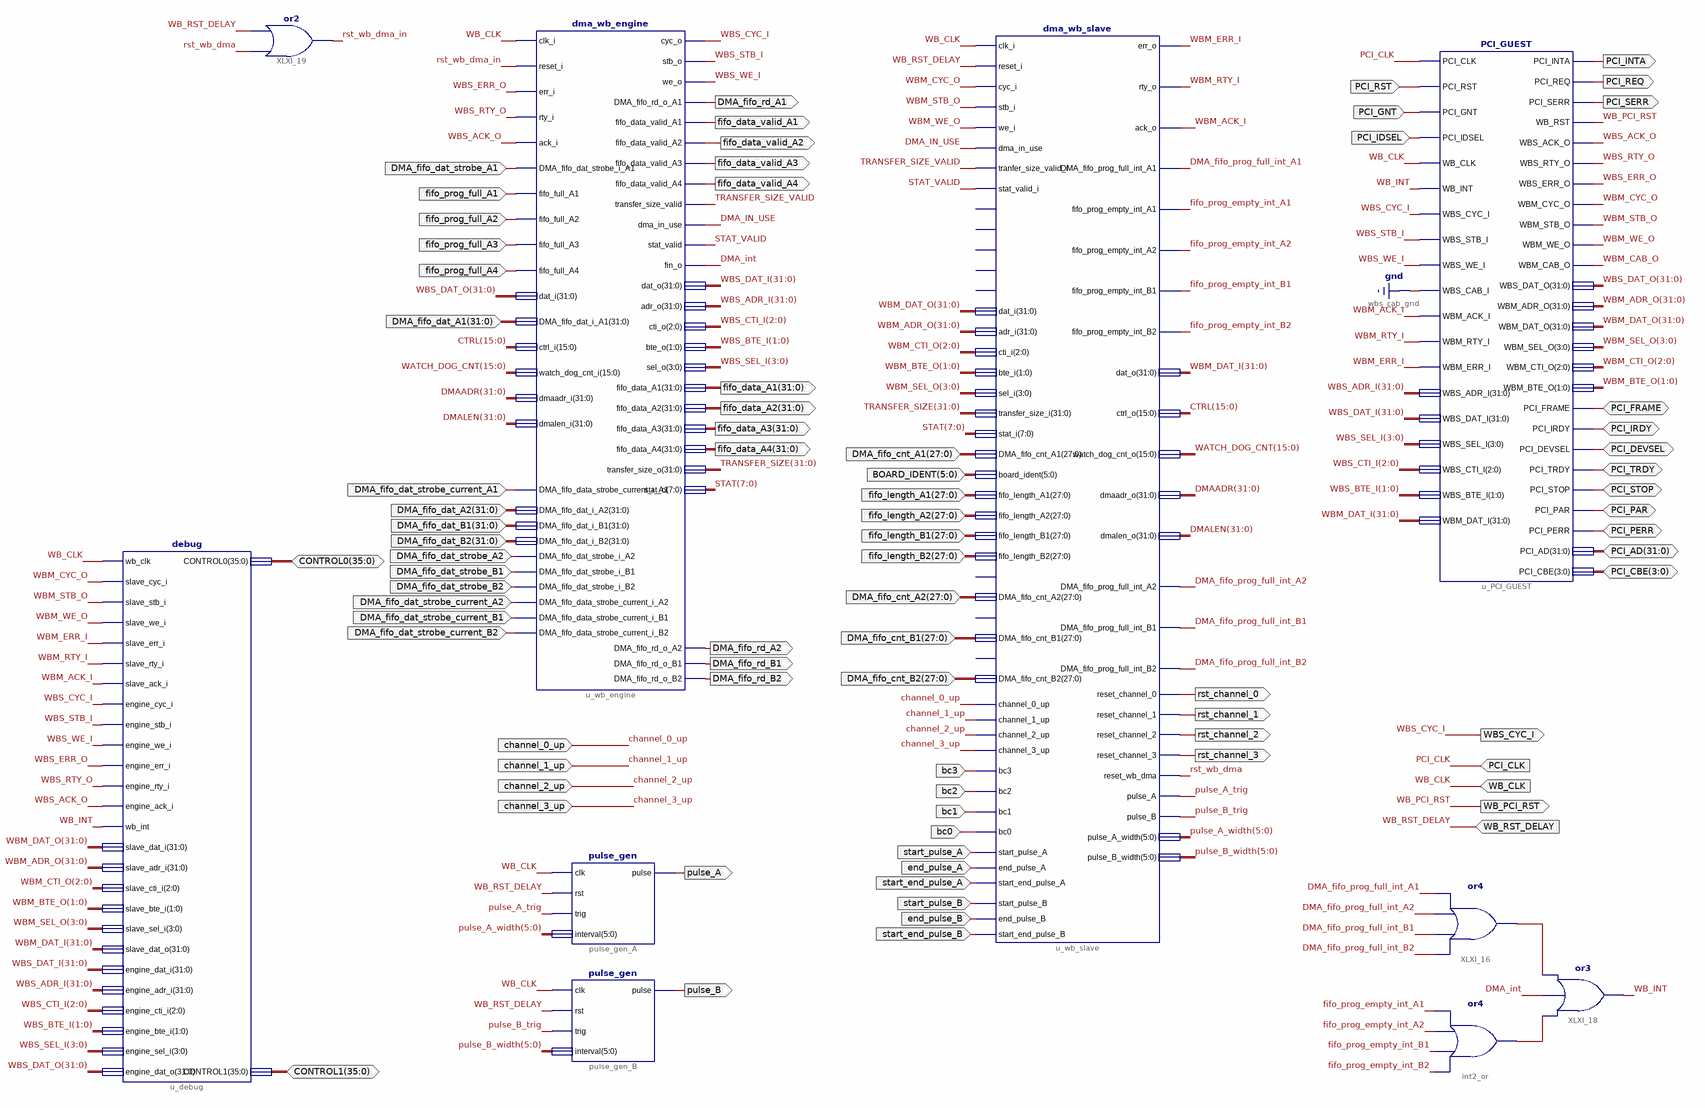
[diagram p0: schematic sheet 1]
// Xilinx ISE schematic DMA_INTERFACE.sch (spartan6) as structural Verilog: 10 symbols, 79 ports
module DMA_INTERFACE (
  input  PCI_CLK,
  input  WB_CLK,
  input  WB_RST_DELAY,
  input  PCI_RST,
  input  PCI_GNT,
  input  PCI_IDSEL,
  input  [27:0] DMA_fifo_cnt_A1,
  input  [5:0] BOARD_IDENT,
  input  [27:0] fifo_length_A1,
  input  [27:0] fifo_length_A2,
  input  [27:0] fifo_length_B1,
  input  [27:0] fifo_length_B2,
  input  [27:0] DMA_fifo_cnt_A2,
  input  [27:0] DMA_fifo_cnt_B1,
  input  [27:0] DMA_fifo_cnt_B2,
  input  DMA_fifo_dat_strobe_A1,
  input  fifo_prog_full_A1,
  input  fifo_prog_full_A2,
  input  fifo_prog_full_A3,
  input  fifo_prog_full_A4,
  input  [31:0] DMA_fifo_dat_A1,
  input  DMA_fifo_dat_strobe_current_A1,
  input  DMA_fifo_dat_strobe_A2,
  input  DMA_fifo_dat_strobe_B1,
  input  DMA_fifo_dat_strobe_B2,
  input  DMA_fifo_dat_strobe_current_A2,
  input  DMA_fifo_dat_strobe_current_B1,
  input  DMA_fifo_dat_strobe_current_B2,
  input  [31:0] DMA_fifo_dat_A2,
  input  [31:0] DMA_fifo_dat_B1,
  input  [31:0] DMA_fifo_dat_B2,
  input  channel_0_up,
  input  channel_1_up,
  input  channel_2_up,
  input  channel_3_up,
  input  bc3,
  input  bc2,
  input  bc1,
  input  bc0,
  input  start_pulse_A,
  input  end_pulse_A,
  input  start_end_pulse_A,
  input  start_pulse_B,
  input  end_pulse_B,
  input  start_end_pulse_B,
  inout  PCI_FRAME,
  inout  PCI_IRDY,
  inout  PCI_DEVSEL,
  inout  PCI_TRDY,
  inout  PCI_STOP,
  inout  PCI_PAR,
  inout  PCI_PERR,
  inout  [31:0] PCI_AD,
  inout  [3:0] PCI_CBE,
  inout  [35:0] CONTROL0,
  inout  [35:0] CONTROL1,
  output WB_PCI_RST,
  output WBS_CYC_I,
  output PCI_INTA,
  output PCI_REQ,
  output PCI_SERR,
  output DMA_fifo_rd_A1,
  output fifo_data_valid_A1,
  output fifo_data_valid_A2,
  output fifo_data_valid_A3,
  output fifo_data_valid_A4,
  output [31:0] fifo_data_A1,
  output [31:0] fifo_data_A2,
  output [31:0] fifo_data_A3,
  output [31:0] fifo_data_A4,
  output DMA_fifo_rd_A2,
  output DMA_fifo_rd_B1,
  output DMA_fifo_rd_B2,
  output rst_channel_0,
  output rst_channel_1,
  output rst_channel_2,
  output rst_channel_3,
  output pulse_A,
  output pulse_B
);

  wire DMA_fifo_prog_full_int_A1, DMA_fifo_prog_full_int_A2, DMA_fifo_prog_full_int_B1,
       DMA_fifo_prog_full_int_B2, DMA_IN_USE, DMA_int, fifo_prog_empty_int_A1, fifo_prog_empty_int_A2,
       fifo_prog_empty_int_B1, fifo_prog_empty_int_B2, pulse_A_trig, pulse_B_trig, rst_wb_dma, rst_wb_dma_in,
       STAT_VALID, TRANSFER_SIZE_VALID, WB_INT, WBM_ACK_I, WBM_CAB_O, WBM_CYC_O, WBM_ERR_I, WBM_RTY_I,
       WBM_STB_O, WBM_WE_O, WBS_ACK_O, WBS_ERR_O, WBS_RTY_O, WBS_STB_I, WBS_WE_I, XLXN_106, XLXN_120;
  wire [1:0] WBM_BTE_O, WBS_BTE_I;
  wire [2:0] WBM_CTI_O, WBS_CTI_I;
  wire [3:0] WBM_SEL_O, WBS_SEL_I;
  wire [5:0] pulse_A_width, pulse_B_width;
  wire [7:0] STAT;
  wire [15:0] CTRL, WATCH_DOG_CNT;
  wire [31:0] DMAADR, DMALEN, TRANSFER_SIZE, WBM_ADR_O, WBM_DAT_I, WBM_DAT_O, WBS_ADR_I, WBS_DAT_I, WBS_DAT_O;

  or int2_or (XLXN_106, fifo_prog_empty_int_B2, fifo_prog_empty_int_B1, fifo_prog_empty_int_A2, fifo_prog_empty_int_A1);
  or XLXI_18 (WB_INT, XLXN_106, DMA_int, XLXN_120);
  or XLXI_16 (XLXN_120, DMA_fifo_prog_full_int_B2, DMA_fifo_prog_full_int_B1, DMA_fifo_prog_full_int_A2, DMA_fifo_prog_full_int_A1);
  PCI_GUEST u_PCI_GUEST (
    .PCI_CLK(PCI_CLK), .PCI_RST(PCI_RST), .PCI_GNT(PCI_GNT), .PCI_IDSEL(PCI_IDSEL), .WB_CLK(WB_CLK),
    .WB_INT(WB_INT), .WBS_CYC_I(WBS_CYC_I), .WBS_STB_I(WBS_STB_I), .WBS_WE_I(WBS_WE_I), .WBS_CAB_I(1'b0),
    .WBM_ACK_I(WBM_ACK_I), .WBM_RTY_I(WBM_RTY_I), .WBM_ERR_I(WBM_ERR_I), .WBS_ADR_I(WBS_ADR_I),
    .WBS_DAT_I(WBS_DAT_I), .WBS_SEL_I(WBS_SEL_I), .WBS_CTI_I(WBS_CTI_I), .WBS_BTE_I(WBS_BTE_I),
    .WBM_DAT_I(WBM_DAT_I), .PCI_INTA(PCI_INTA), .PCI_REQ(PCI_REQ), .PCI_SERR(PCI_SERR), .WB_RST(WB_PCI_RST),
    .WBS_ACK_O(WBS_ACK_O), .WBS_RTY_O(WBS_RTY_O), .WBS_ERR_O(WBS_ERR_O), .WBM_CYC_O(WBM_CYC_O),
    .WBM_STB_O(WBM_STB_O), .WBM_WE_O(WBM_WE_O), .WBM_CAB_O(WBM_CAB_O), .WBS_DAT_O(WBS_DAT_O),
    .WBM_ADR_O(WBM_ADR_O), .WBM_DAT_O(WBM_DAT_O), .WBM_SEL_O(WBM_SEL_O), .WBM_CTI_O(WBM_CTI_O),
    .WBM_BTE_O(WBM_BTE_O), .PCI_FRAME(PCI_FRAME), .PCI_IRDY(PCI_IRDY), .PCI_DEVSEL(PCI_DEVSEL),
    .PCI_TRDY(PCI_TRDY), .PCI_STOP(PCI_STOP), .PCI_PAR(PCI_PAR), .PCI_PERR(PCI_PERR), .PCI_AD(PCI_AD),
    .PCI_CBE(PCI_CBE));
  dma_wb_slave u_wb_slave (
    .clk_i(WB_CLK), .reset_i(WB_RST_DELAY), .cyc_i(WBM_CYC_O), .stb_i(WBM_STB_O), .we_i(WBM_WE_O),
    .dma_in_use(DMA_IN_USE), .tranfer_size_valid_i(TRANSFER_SIZE_VALID), .stat_valid_i(STAT_VALID),
    .dat_i(WBM_DAT_O), .adr_i(WBM_ADR_O), .cti_i(WBM_CTI_O), .bte_i(WBM_BTE_O), .sel_i(WBM_SEL_O),
    .transfer_size_i(TRANSFER_SIZE), .stat_i(STAT), .DMA_fifo_cnt_A1(DMA_fifo_cnt_A1),
    .board_ident(BOARD_IDENT), .fifo_length_A1(fifo_length_A1), .fifo_length_A2(fifo_length_A2),
    .fifo_length_B1(fifo_length_B1), .fifo_length_B2(fifo_length_B2), .err_o(WBM_ERR_I), .rty_o(WBM_RTY_I),
    .ack_o(WBM_ACK_I), .DMA_fifo_prog_full_int_A1(DMA_fifo_prog_full_int_A1),
    .fifo_prog_empty_int_A1(fifo_prog_empty_int_A1), .fifo_prog_empty_int_A2(fifo_prog_empty_int_A2),
    .fifo_prog_empty_int_B1(fifo_prog_empty_int_B1), .fifo_prog_empty_int_B2(fifo_prog_empty_int_B2),
    .dat_o(WBM_DAT_I), .ctrl_o(CTRL), .watch_dog_cnt_o(WATCH_DOG_CNT), .dmaadr_o(DMAADR), .dmalen_o(DMALEN),
    .DMA_fifo_cnt_A2(DMA_fifo_cnt_A2), .DMA_fifo_cnt_B1(DMA_fifo_cnt_B1), .DMA_fifo_cnt_B2(DMA_fifo_cnt_B2),
    .DMA_fifo_prog_full_int_A2(DMA_fifo_prog_full_int_A2),
    .DMA_fifo_prog_full_int_B1(DMA_fifo_prog_full_int_B1),
    .DMA_fifo_prog_full_int_B2(DMA_fifo_prog_full_int_B2), .reset_channel_0(rst_channel_0),
    .reset_channel_1(rst_channel_1), .reset_channel_2(rst_channel_2), .reset_channel_3(rst_channel_3),
    .reset_wb_dma(rst_wb_dma), .channel_0_up(channel_0_up), .channel_1_up(channel_1_up),
    .channel_2_up(channel_2_up), .channel_3_up(channel_3_up), .pulse_A(pulse_A_trig), .pulse_B(pulse_B_trig),
    .pulse_A_width(pulse_A_width), .pulse_B_width(pulse_B_width), .bc3(bc3), .bc2(bc2), .bc1(bc1), .bc0(bc0),
    .start_pulse_A(start_pulse_A), .end_pulse_A(end_pulse_A), .start_end_pulse_A(start_end_pulse_A),
    .start_pulse_B(start_pulse_B), .end_pulse_B(end_pulse_B), .start_end_pulse_B(start_end_pulse_B));  // open: DMA_fifo_prog_full_A1, fifo_prog_empty_A1, fifo_prog_empty_A2, fifo_prog_empty_B1, fifo_prog_empty_B2, DMA_fifo_prog_full_A2, DMA_fifo_prog_full_B1, DMA_fifo_prog_full_B2
  dma_wb_engine u_wb_engine (
    .clk_i(WB_CLK), .reset_i(rst_wb_dma_in), .err_i(WBS_ERR_O), .rty_i(WBS_RTY_O), .ack_i(WBS_ACK_O),
    .DMA_fifo_dat_strobe_i_A1(DMA_fifo_dat_strobe_A1), .fifo_full_A1(fifo_prog_full_A1),
    .fifo_full_A2(fifo_prog_full_A2), .fifo_full_A3(fifo_prog_full_A3), .fifo_full_A4(fifo_prog_full_A4),
    .dat_i(WBS_DAT_O), .DMA_fifo_dat_i_A1(DMA_fifo_dat_A1), .ctrl_i(CTRL), .watch_dog_cnt_i(WATCH_DOG_CNT),
    .dmaadr_i(DMAADR), .dmalen_i(DMALEN), .cyc_o(WBS_CYC_I), .stb_o(WBS_STB_I), .we_o(WBS_WE_I),
    .DMA_fifo_rd_o_A1(DMA_fifo_rd_A1), .fifo_data_valid_A1(fifo_data_valid_A1),
    .fifo_data_valid_A2(fifo_data_valid_A2), .fifo_data_valid_A3(fifo_data_valid_A3),
    .fifo_data_valid_A4(fifo_data_valid_A4), .transfer_size_valid(TRANSFER_SIZE_VALID),
    .dma_in_use(DMA_IN_USE), .stat_valid(STAT_VALID), .fin_o(DMA_int), .dat_o(WBS_DAT_I), .adr_o(WBS_ADR_I),
    .cti_o(WBS_CTI_I), .bte_o(WBS_BTE_I), .sel_o(WBS_SEL_I), .fifo_data_A1(fifo_data_A1),
    .fifo_data_A2(fifo_data_A2), .fifo_data_A3(fifo_data_A3), .fifo_data_A4(fifo_data_A4),
    .transfer_size_o(TRANSFER_SIZE), .stat_o(STAT),
    .DMA_fifo_data_strobe_current_i_A1(DMA_fifo_dat_strobe_current_A1), .DMA_fifo_dat_i_A2(DMA_fifo_dat_A2),
    .DMA_fifo_dat_i_B2(DMA_fifo_dat_B2), .DMA_fifo_dat_strobe_i_A2(DMA_fifo_dat_strobe_A2),
    .DMA_fifo_dat_strobe_i_B1(DMA_fifo_dat_strobe_B1), .DMA_fifo_dat_strobe_i_B2(DMA_fifo_dat_strobe_B2),
    .DMA_fifo_data_strobe_current_i_A2(DMA_fifo_dat_strobe_current_A2),
    .DMA_fifo_data_strobe_current_i_B1(DMA_fifo_dat_strobe_current_B1),
    .DMA_fifo_data_strobe_current_i_B2(DMA_fifo_dat_strobe_current_B2), .DMA_fifo_rd_o_A2(DMA_fifo_rd_A2),
    .DMA_fifo_rd_o_B1(DMA_fifo_rd_B1), .DMA_fifo_rd_o_B2(DMA_fifo_rd_B2), .DMA_fifo_dat_i_B1(DMA_fifo_dat_B1));
  debug u_debug (
    .wb_clk(WB_CLK), .slave_cyc_i(WBM_CYC_O), .slave_stb_i(WBM_STB_O), .slave_we_i(WBM_WE_O),
    .slave_err_i(WBM_ERR_I), .slave_rty_i(WBM_RTY_I), .slave_ack_i(WBM_ACK_I), .engine_cyc_i(WBS_CYC_I),
    .engine_stb_i(WBS_STB_I), .engine_we_i(WBS_WE_I), .engine_err_i(WBS_ERR_O), .engine_rty_i(WBS_RTY_O),
    .engine_ack_i(WBS_ACK_O), .wb_int(WB_INT), .slave_dat_i(WBM_DAT_O), .slave_adr_i(WBM_ADR_O),
    .slave_cti_i(WBM_CTI_O), .slave_bte_i(WBM_BTE_O), .slave_sel_i(WBM_SEL_O), .slave_dat_o(WBM_DAT_I),
    .engine_dat_i(WBS_DAT_I), .engine_adr_i(WBS_ADR_I), .engine_cti_i(WBS_CTI_I), .engine_bte_i(WBS_BTE_I),
    .engine_sel_i(WBS_SEL_I), .engine_dat_o(WBS_DAT_O), .CONTROL0(CONTROL0), .CONTROL1(CONTROL1));
  or XLXI_19 (rst_wb_dma_in, rst_wb_dma, WB_RST_DELAY);
  pulse_gen pulse_gen_B (
    .clk(WB_CLK), .rst(WB_RST_DELAY), .trig(pulse_B_trig), .interval(pulse_B_width), .pulse(pulse_B));
  pulse_gen pulse_gen_A (
    .clk(WB_CLK), .rst(WB_RST_DELAY), .trig(pulse_A_trig), .interval(pulse_A_width), .pulse(pulse_A));
endmodule
